# EAGLE design Hex Motor Module (EAGLE 6.1)
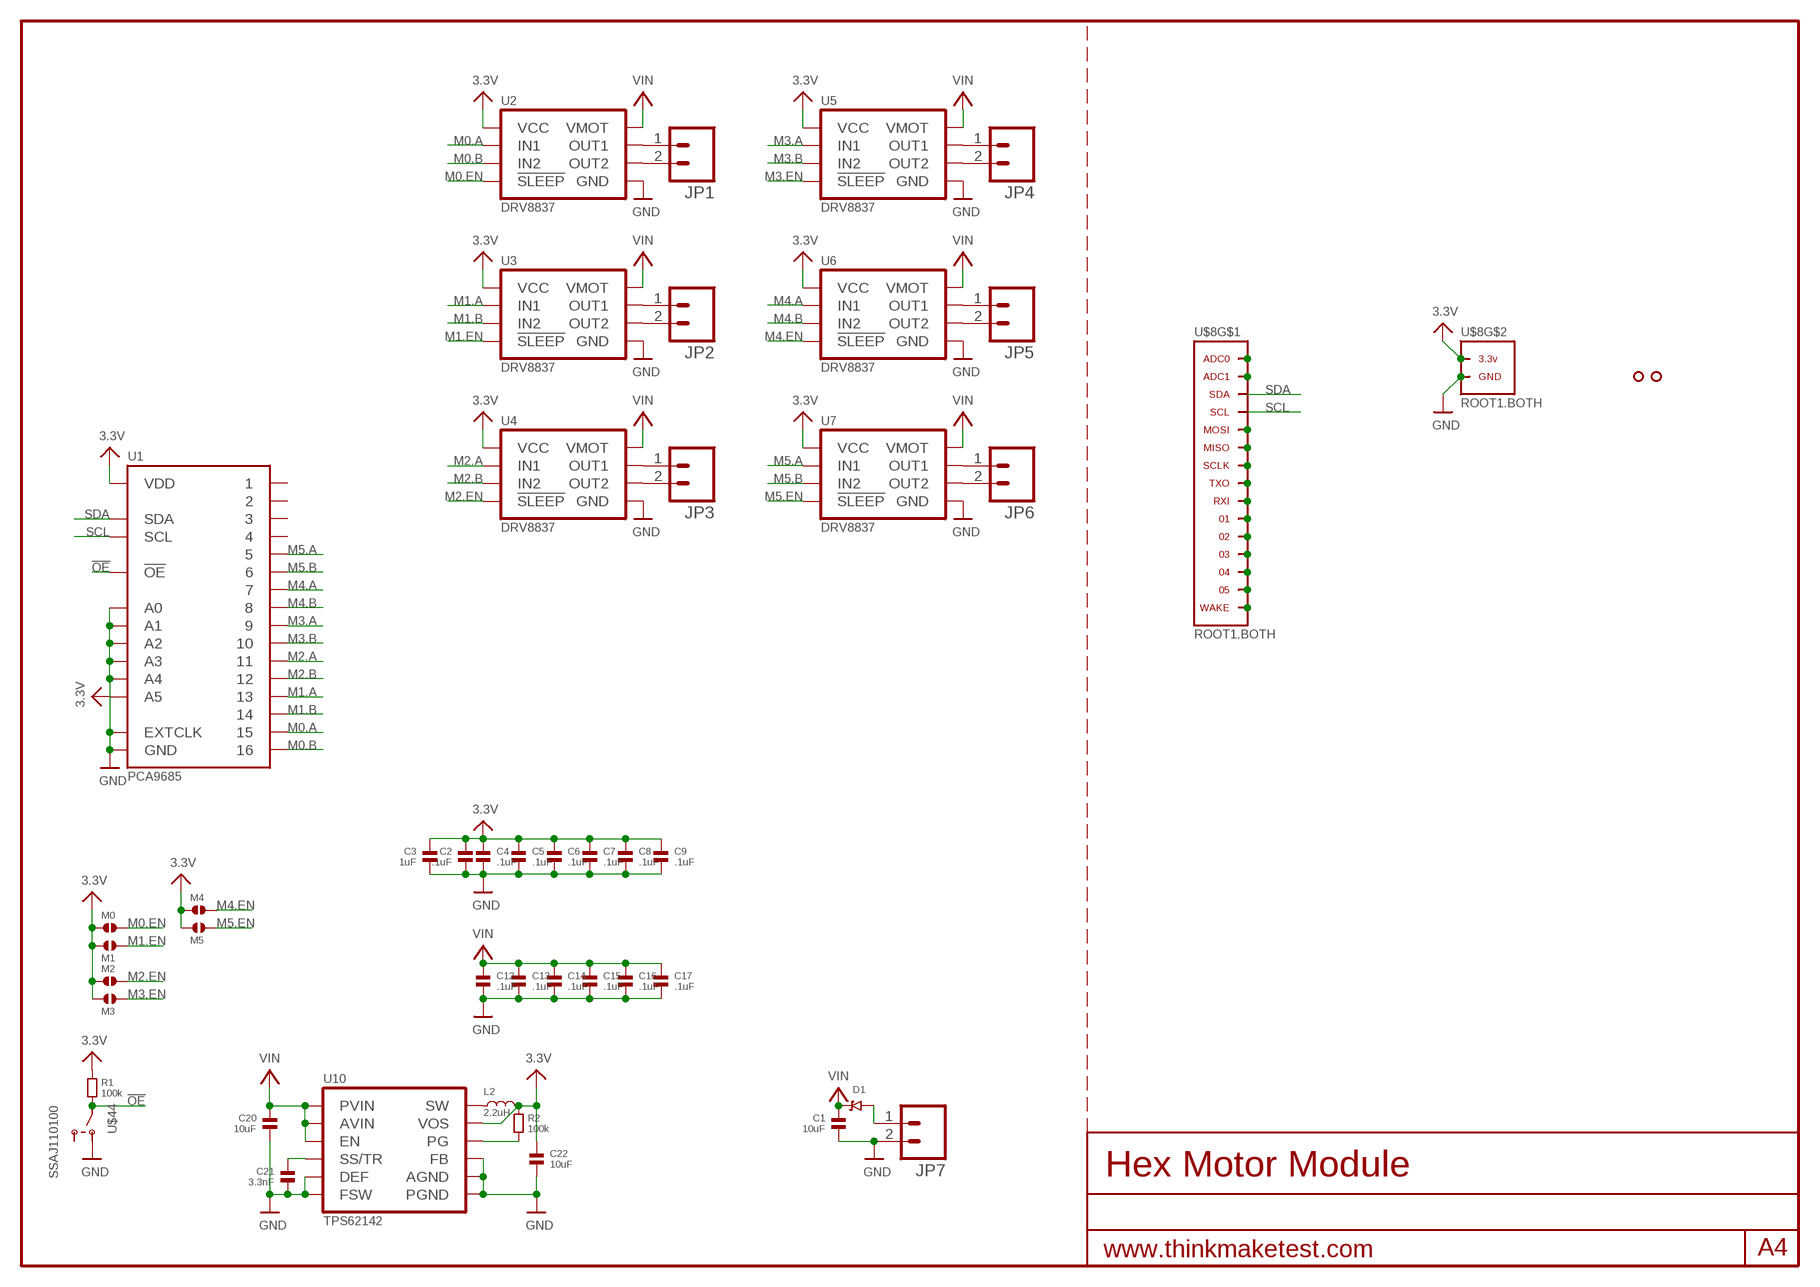
[diagram p0: schematic, sheet 1]

## Parts
C1  10uF  CAPACITOR.1206  [1206]
C2  .1uF  CAPACITOR.0603  [0603]
C3  1uF  CAPACITOR.0603  [0603]
C4  .1uF  CAPACITOR.0402  [0402]
C5  .1uF  CAPACITOR.0402  [0402]
C6  .1uF  CAPACITOR.0402  [0402]
C7  .1uF  CAPACITOR.0402  [0402]
C8  .1uF  CAPACITOR.0402  [0402]
C9  .1uF  CAPACITOR.0402  [0402]
C12  .1uF  CAPACITOR.0402  [0402]
C13  .1uF  CAPACITOR.0402  [0402]
C14  .1uF  CAPACITOR.0402  [0402]
C15  .1uF  CAPACITOR.0402  [0402]
C16  .1uF  CAPACITOR.0402  [0402]
C17  .1uF  CAPACITOR.0402  [0402]
C20  10uF  CAPACITOR.0805  [0805]
C21  3.3nF  CAPACITOR.0603  [0603]
C22  10uF  CAPACITOR.0805  [0805]
D1  DIODE[SCHOTKY]-SOD123W  [SOD123W]
JP1  M023.5MM_LOCK  [SCREWTERMINAL-3.5MM-2_LOCK]
JP2  M023.5MM_LOCK  [SCREWTERMINAL-3.5MM-2_LOCK]
JP3  M023.5MM_LOCK  [SCREWTERMINAL-3.5MM-2_LOCK]
JP4  M023.5MM_LOCK  [SCREWTERMINAL-3.5MM-2_LOCK]
JP5  M023.5MM_LOCK  [SCREWTERMINAL-3.5MM-2_LOCK]
JP6  M023.5MM_LOCK  [SCREWTERMINAL-3.5MM-2_LOCK]
JP7  M023.5MM_LOCK  [SCREWTERMINAL-3.5MM-2_LOCK]
L2  2.2uH  INDUCTOR-SRP4020  [SRP4020]
M0  SOLDERJUMPER.2.LRG.PASTE  [2.LRG.PASTE]
M1  SOLDERJUMPER.2.LRG.PASTE  [2.LRG.PASTE]
M2  SOLDERJUMPER.2.LRG.PASTE  [2.LRG.PASTE]
M3  SOLDERJUMPER.2.LRG.PASTE  [2.LRG.PASTE]
M4  SOLDERJUMPER.2.LRG.PASTE  [2.LRG.PASTE]
M5  SOLDERJUMPER.2.LRG.PASTE  [2.LRG.PASTE]
R1  100k  RESISTOR.0603  [0603]
R2  100k  RESISTOR.0603  [0603]
U1  PCA9685  [HVQFN28]
U2  DRV8837  [DSG]
U3  DRV8837  [DSG]
U4  DRV8837  [DSG]
U5  DRV8837  [DSG]
U6  DRV8837  [DSG]
U7  DRV8837  [DSG]
U10  TPS62142  TPS6214X  [RGT]
U$3  HOLE.2MM  [2MM]
U$4  HOLE.2MM  [2MM]
U$8  ROOT1.BOTH  [ROOT1.BOTH]
U$44  SSAJ110100  [SSAJ110100]

## Nets
3.3V: C2.1 C3.1 C4.1 C5.1 C6.1 C7.1 C8.1 C9.1 C22.1 L2.2 M0.1 M1.1 M2.1 M3.1 M4.1 M5.1 R1.1 R2.1 U1.24(A5) U1.28(VDD) U2.8(VCC) U3.8(VCC) U4.8(VCC) U5.8(VCC) U6.8(VCC) U7.8(VCC) U10.14(VOS) U$8.3.3V@1(3.3V) U$8.3.3V@2(3.3V) U$8.3.3V@3(3.3V) U$8.3.3V@4(3.3V) U$8.3.3V@5(3.3V) U$8.3.3V@6(3.3V) U$8.3.3V@7(3.3V) U$8.3.3V@8(3.3V) U$8.3.3V@9(3.3V) U$8.3.3V@10(3.3V) U$8.3.3V@VIA(3.3V)
!OE: R1.2 U1.23(!OE) U$44.C
GND: C1.2 C2.2 C3.2 C4.2 C5.2 C6.2 C7.2 C8.2 C9.2 C12.2 C13.2 C14.2 C15.2 C16.2 C17.2 C20.2 C21.2 C22.2 JP7.2 U1.1(A0) U1.2(A1) U1.3(A2) U1.4(A3) U1.5(A4) U1.14(GND) U1.25(EXTCLK) U1.PAD(GND) U2.4(GND) U2.PAD(GND) U3.4(GND) U3.PAD(GND) U4.4(GND) U4.PAD(GND) U5.4(GND) U5.PAD(GND) U6.4(GND) U6.PAD(GND) U7.4(GND) U7.PAD(GND) U10.5(FB) U10.6(AGND) U10.7(FSW) U10.8(DEF) U10.15(PGND) U10.16(PGND) U10.PAD(AGND) U$8.GND@1(GND) U$8.GND@2(GND) U$8.GND@3(GND) U$8.GND@4(GND) U$8.GND@5(GND) U$8.GND@6(GND) U$8.GND@7(GND) U$8.GND@8(GND) U$8.GND@9(GND) U$8.GND@10(GND) U$8.GND@11(GND) U$8.GND@12(GND) U$8.GND@13(GND) U$8.GND@14(GND) U$8.GND@15(GND) U$8.GND@16(GND) U$8.GND@17(GND) U$8.GND@18(GND) U$8.GND@19(GND) U$8.GND@20(GND) U$8.GND@VIA(GND) U$44.1
M0.A: U1.21 U2.6(IN1)
M0.B: U1.22 U2.5(IN2)
M0.EN: M0.2 U2.7(!SLEEP)
M1.A: U1.19 U3.6(IN1)
M1.B: U1.20 U3.5(IN2)
M1.EN: M1.2 U3.7(!SLEEP)
M2.A: U1.17 U4.6(IN1)
M2.B: U1.18 U4.5(IN2)
M2.EN: M2.2 U4.7(!SLEEP)
M3.A: U1.15 U5.6(IN1)
M3.B: U1.16 U5.5(IN2)
M3.EN: M3.2 U5.7(!SLEEP)
M4.A: U1.12 U6.6(IN1)
M4.B: U1.13 U6.5(IN2)
M4.EN: M4.2 U6.7(!SLEEP)
M5.A: U1.10 U7.6(IN1)
M5.B: U1.11 U7.5(IN2)
M5.EN: M5.2 U7.7(!SLEEP)
N$1: U$8.ADC0 U$8.ADC0@1(ADC0) U$8.ADC0@VIA(ADC0)
N$2: U$8.ADC1 U$8.ADC1@1(ADC1) U$8.ADC1@VIA(ADC1)
N$3: L2.1 U10.1(SW) U10.2(SW) U10.3(SW)
N$4: R2.2 U10.4(PG)
N$5: U$8.MOSI U$8.MOSI@1(MOSI) U$8.MOSI@VIA(MOSI)
N$6: U$8.MISO U$8.MISO@1(MISO) U$8.MISO@VIA(MISO)
N$7: U$8.SCLK U$8.SCLK@1(SCLK) U$8.SCLK@VIA(SCLK)
N$8: U$8.01(TXO) U$8.01@1(TXO) U$8.01@VIA(TXO)
N$9: U$8.02(RXI) U$8.02@1(RXI) U$8.02@VIA(RXI)
N$10: U$8.03 U$8.03@1 U$8.03@VIA
N$11: U$8.04 U$8.04@1 U$8.04@VIA
N$12: U$8.05 U$8.05@1 U$8.05@VIA
N$13: U$8.06 U$8.06@1 U$8.06@VIA
N$14: U$8.07 U$8.07@1 U$8.07@VIA
N$15: U$8.WAKE U$8.WAKE@1(WAKE) U$8.WAKE@VIA(WAKE)
N$16: JP1.1 U2.2(OUT1)
N$17: JP1.2 U2.3(OUT2)
N$18: JP4.1 U5.2(OUT1)
N$19: JP4.2 U5.3(OUT2)
N$20: JP5.1 U6.2(OUT1)
N$21: JP5.2 U6.3(OUT2)
N$22: JP6.1 U7.2(OUT1)
N$23: JP6.2 U7.3(OUT2)
N$24: JP3.1 U4.2(OUT1)
N$25: JP3.2 U4.3(OUT2)
N$26: JP2.1 U3.2(OUT1)
N$27: JP2.2 U3.3(OUT2)
N$32: D1.P$1 JP7.1
N$33: C21.1 U10.9(SS/TR)
SCL: U1.26(SCL) U$8.SCL U$8.SCL@1(SCL) U$8.SCL@VIA(SCL)
SDA: U1.27(SDA) U$8.SDA U$8.SDA@1(SDA) U$8.SDA@VIA(SDA)
VIN: C1.1 C12.1 C13.1 C14.1 C15.1 C16.1 C17.1 C20.1 D1.P$2 U2.1(VMOT) U3.1(VMOT) U4.1(VMOT) U5.1(VMOT) U6.1(VMOT) U7.1(VMOT) U10.10(AVIN) U10.11(PVIN) U10.12(PVIN) U10.13(EN)
Unconnected: U1.6 U1.7 U1.8 U1.9 U$44.2

## Library data of the parts
C1-C9 C12-C17 C20-C22 = .standardparts:CAPACITOR
D1 = nxp:DIODE[SCHOTKY]
JP1-JP7 = SparkFun:M02: Header 2 Standard 2-pin 0.1" header. Use with straight break away headers (SKU : PRT-00116), right angle break away headers (PRT-00553), swiss pins (PRT-00743), machine pins (PRT-00117), and female headers (PRT-00115). Molex polarized connector foot print use with SKU : PRT-08233 with associated crimp pins and housings.
L2 = bourns:INDUCTOR
M0 M1-M5 = .solderjumper:SOLDERJUMPER.2
R1 R2 = .standardparts:RESISTOR
U1 = nxp:PCA9685
U2-U7 = .packages(ti):DRV8837
U10 = .packages(ti):TPS6214X
U$3 U$4 = .screw_holes:HOLE
U$8 = thinkmaketest:ROOT1
U$44 = alps:SSAJ110100

## Board
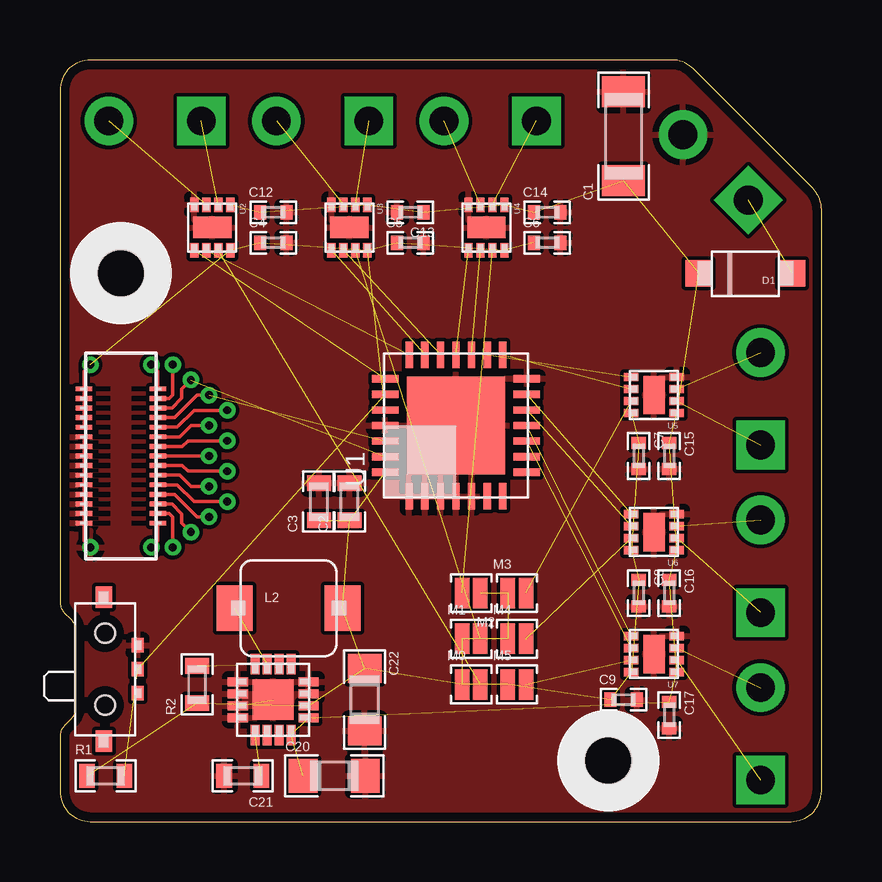
[diagram p1: board, top side]
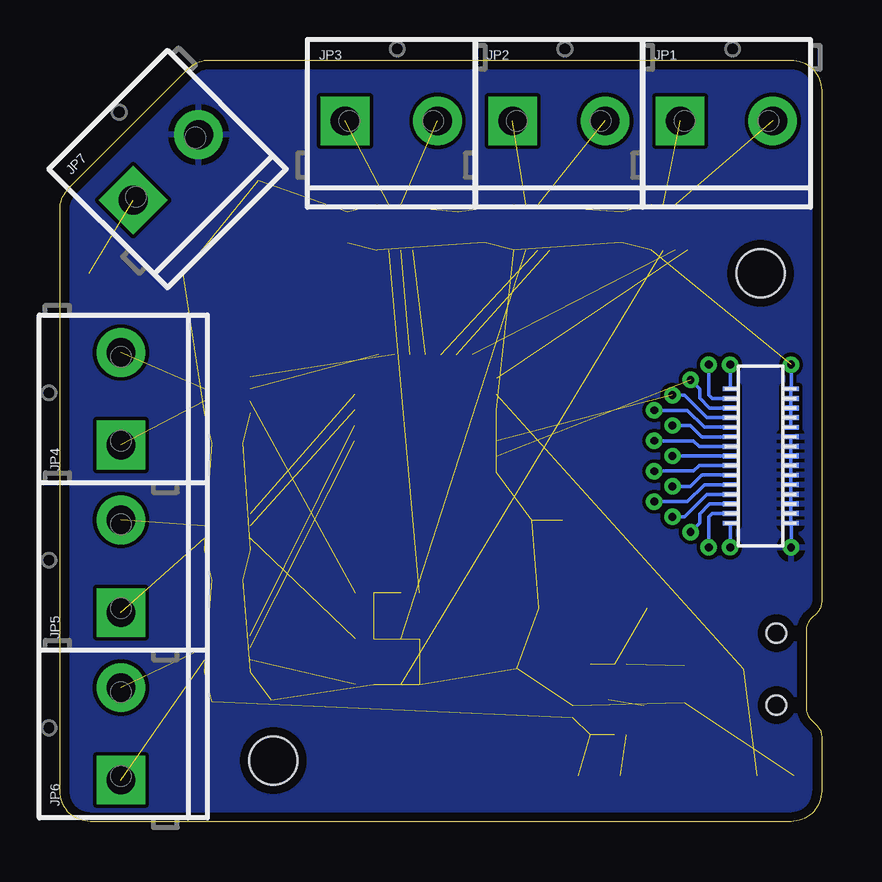
[diagram p2: board, bottom side, seen from below]

Size 31.75 x 31.75 mm. Coordinates in mm from the lower left corner, seen from the top.
Outline: 1.27,0 30.48,0 arc90 31.75,1.27 31.75,25.51 arc45 31.38,26.41 26.41,31.38 arc45 25.51,31.75 1.27,31.75 arc90 0,30.48 0,9.15 arc45 0.19,8.7 0.45,8.44 arc-45 0.64,7.99 0.64,4.71 arc-45 0.45,4.26 0.19,4 arc45 0,3.55 0,1.27 arc90 1.27,0
Copper layers (1*16): Top 0.0356mm / dielectric 1.5011mm / Bottom 0.0356mm
Design rules: minimum track width 6mil, minimum drill 13mil, track to track 6mil, track to pad 6mil, pad to pad 6mil, via to via 6mil, smd to smd 6mil, copper to edge 15mil, drill to drill 6mil, minimum pad ring 7mil, minimum via ring 7mil, stop-mask expansion 4mil, vias tented up to drill 16mil, thermal gap 10mil

### Footprints (pad centres in the part's own frame; a part is rotated, then mirrored left to right if it is on the bottom)
1206 = smd 1.3 x 1.8: 1 -1.85,0; 2 1.85,0
0603 = smd 0.65 x 1: 1 -0.775,0; 2 0.775,0
0402 = smd 0.5 x 0.6: 1 -0.55,0; 2 0.55,0
0805 = smd 1.2 x 1.4: 1 -1.3,0; 2 1.3,0
SOD123W = smd 1.1 x 1.1: P$1 -1.95,0; P$2 1.95,0
SCREWTERMINAL-3.5MM-2_LOCK = drill 1.2 pad 2.032 square: 1 -0.178,0 | drill 1.2 pad 2.032: 2 3.678,0
SRP4020 = smd 1.5 x 1.9: 1 -2.25,0; 2 2.25,0
2.LRG.PASTE = smd 0.61 x 1.27: 1 -0.381,0; 2 0.381,0
HVQFN28 = smd 1.1 x 0.3: 1 -2.95,1.95; 2 -2.95,1.3; 3 -2.95,0.65; 4 -2.95,0; 5 -2.95,-0.65; 6 -2.95,-1.3; 7 -2.95,-1.95; 15 2.95,-1.95; 16 2.95,-1.3; 17 2.95,-0.65; 18 2.95,0; 19 2.95,0.65; 20 2.95,1.3; 21 2.95,1.95 | smd 0.3 x 1.1: 8 -1.95,-2.95; 9 -1.3,-2.95; 10 -0.65,-2.95; 11 0,-2.95; 12 0.65,-2.95; 13 1.3,-2.95; 14 1.95,-2.95; 22 1.95,2.95; 23 1.3,2.95; 24 0.65,2.95; 25 0,2.95; 26 -0.65,2.95; 27 -1.3,2.95; 28 -1.95,2.95 | smd 4.1 x 4.1: PAD 0,0
DSG = smd 0.6 x 0.35: 1 -0.95,0.75; 2 -0.95,0.25; 3 -0.95,-0.25; 4 -0.95,-0.75; 5 0.95,-0.75; 6 0.95,-0.25; 7 0.95,0.25; 8 0.95,0.75 | smd 0.9 x 1.6: PAD 0,0
RGT = smd 0.85 x 0.38: 1 -1.475,0.75; 2 -1.475,0.25; 3 -1.475,-0.25; 4 -1.475,-0.75; 9 1.475,-0.75; 10 1.475,-0.25; 11 1.475,0.25; 12 1.475,0.75 | smd 0.38 x 0.85: 5 -0.75,-1.475; 6 -0.25,-1.475; 7 0.25,-1.475; 8 0.75,-1.475; 13 0.75,1.475; 14 0.25,1.475; 15 -0.25,1.475; 16 -0.75,1.475 | smd 1.7 x 1.7: PAD 0,0
2MM = hole 2: 0,0
ROOT1.BOTH = smd 0.7 x 0.2: 01 4.08,15.24; 02 4.08,14.84; 03 4.08,14.44; 3.3V@1 1,18.04; 3.3V@2 1,17.64; 3.3V@3 1,17.24; 3.3V@4 1,16.84; 3.3V@5 1,16.44; 04 4.08,14.04; 05 4.08,13.64; 06 4.08,13.24; 07 4.08,12.84; ADC0 4.08,18.04; ADC1 4.08,17.64; GND@1 1,16.04; GND@2 1,15.64; GND@3 1,15.24; GND@4 1,14.84; GND@5 1,14.44; GND@6 1,14.04; GND@7 1,13.64; GND@8 1,13.24; GND@9 1,12.84; GND@10 1,12.44; MISO 4.08,16.04; MOSI 4.08,16.44; SCL 4.08,16.84; SCLK 4.08,15.64; SDA 4.08,17.24; WAKE 4.08,12.44 | smd 0.66 x 0.2 bottom: 01@1 3.795,15.24; 02@1 3.795,14.84; 3.3V@6 1.285,16.44; 3.3V@7 1.285,16.84; 3.3V@8 1.285,17.24; 3.3V@9 1.285,17.64; 3.3V@10 1.285,18.04; 03@1 3.795,14.44; 04@1 3.795,14.04; 05@1 3.795,13.64; 06@1 3.795,13.24; 07@1 3.795,12.84; ADC0@1 3.795,18.04; ADC1@1 3.795,17.64; GND@11 1.285,12.44; GND@12 1.285,12.84; GND@13 1.285,13.24; GND@14 1.285,13.64; GND@15 1.285,14.04; GND@16 1.285,14.44; GND@17 1.285,14.84; GND@18 1.285,15.24; GND@19 1.285,15.64; GND@20 1.285,16.04; MISO@1 3.795,16.04; MOSI@1 3.795,16.44; SCL@1 3.795,16.84; SCLK@1 3.795,15.64; SDA@1 3.795,17.24; WAKE@1 3.795,12.44 | drill 0.33 pad 0.686: 01@VIA 6.215,15.24; 02@VIA 6.973,14.605; 3.3V@VIA 1.27,19.05; 03@VIA 6.215,13.97; 04@VIA 6.973,13.335; 05@VIA 6.215,12.7; 06@VIA 5.457,12.065; 07@VIA 4.699,11.43; ADC0@VIA 3.81,19.05; ADC1@VIA 4.699,19.05; GND@VIA 1.27,11.43; MISO@VIA 6.215,16.51; MOSI@VIA 6.973,17.145; SCL@VIA 6.215,17.78; SCLK@VIA 6.973,15.875; SDA@VIA 5.457,18.415; WAKE@VIA 3.81,11.43
SSAJ110100 = smd 0.6 x 0.5: 1 -1,2.6; 2 1,2.6; C 0,2.6 | smd 0.9 x 0.7: PAD@1 3,1.2; PAD@2 -3,1.2 | hole 0.8: -1.5,1.25; 1.5,1.25

### Placement (x,y rotation side)
C1  23.5,28.57 90 top
C2  12.06,13.34 90 top
C3  10.79,13.34 90 top
C4  8.89,24.13 0 top
C5  14.61,24.13 0 top
C6  20.32,24.13 0 top
C7  24.13,15.24 270 top
C8  24.13,9.53 270 top
C9  23.5,5.08 0 top
C12  8.89,25.4 0 top
C13  14.61,25.4 180 top
C14  20.32,25.4 0 top
C15  25.4,15.24 270 top
C16  25.4,9.53 270 top
C17  25.4,4.45 270 top
C20  11.43,1.91 0 top
C21  7.62,1.91 180 top
C22  12.7,5.08 270 top
D1  28.57,22.86 180 top
JP1  5.71,29.21 0 bottom
JP2  12.7,29.21 0 bottom
JP3  19.68,29.21 0 bottom
JP4  29.21,15.88 90 bottom
JP5  29.21,8.89 90 bottom
JP6  29.21,1.91 90 bottom
JP7  28.57,26.04 45 bottom
L2  9.53,8.89 0 top
M0  17.14,5.71 0 top
M1  17.14,7.62 0 top
M2  17.14,9.53 180 top
M3  19.05,9.53 0 top
M4  19.05,7.62 0 top
M5  19.05,5.71 0 top
R1  1.91,1.91 0 top
R2  5.71,5.71 90 top
U1  16.51,16.51 90 top
U2  6.35,24.77 270 top
U3  12.06,24.77 270 top
U4  17.78,24.77 270 top
U5  24.77,17.78 180 top
U6  24.77,12.06 180 top
U7  24.77,6.99 180 top
U10  8.89,5.08 270 top
U$3  22.86,2.54 90 top
U$4  2.54,22.86 90 top
U$8  0,0 0 top
U$44  0.64,6.35 270 top

### Tracks (layer width: path | path; a pad name or v marks a point on that pad's centre or on a via)
3.3V  (27 unrouted)
!OE  (2 unrouted)
GND  (1 unrouted)
  pour Bottom (rank 6): 0,0 31.75,0 31.75,31.75 0,31.75
  pour Top (rank 6): 0,0 31.75,0 31.75,31.75 0,31.75
M0.A  (1 unrouted)
M0.B  (1 unrouted)
M0.EN  (1 unrouted)
M1.A  (1 unrouted)
M1.B  (1 unrouted)
M1.EN  (1 unrouted)
M2.A  (1 unrouted)
M2.B  (1 unrouted)
M2.EN  (1 unrouted)
M3.A  (1 unrouted)
M3.B  (1 unrouted)
M3.EN  (1 unrouted)
M4.A  (1 unrouted)
M4.B  (1 unrouted)
M4.EN  (1 unrouted)
M5.A  (1 unrouted)
M5.B  (1 unrouted)
M5.EN  (1 unrouted)
N$3  (3 unrouted)
N$4  (1 unrouted)
N$16  (1 unrouted)
N$17  (1 unrouted)
N$18  (1 unrouted)
N$19  (1 unrouted)
N$20  (1 unrouted)
N$21  (1 unrouted)
N$22  (1 unrouted)
N$23  (1 unrouted)
N$24  (1 unrouted)
N$25  (1 unrouted)
N$26  (1 unrouted)
N$27  (1 unrouted)
N$32  (1 unrouted)
N$33  (1 unrouted)
SCL  (1 unrouted)
SDA  (1 unrouted)
VIN  (18 unrouted)